# Altium project LSS_Top_Board_v3.5.PrjPcb (part 5 of 5)
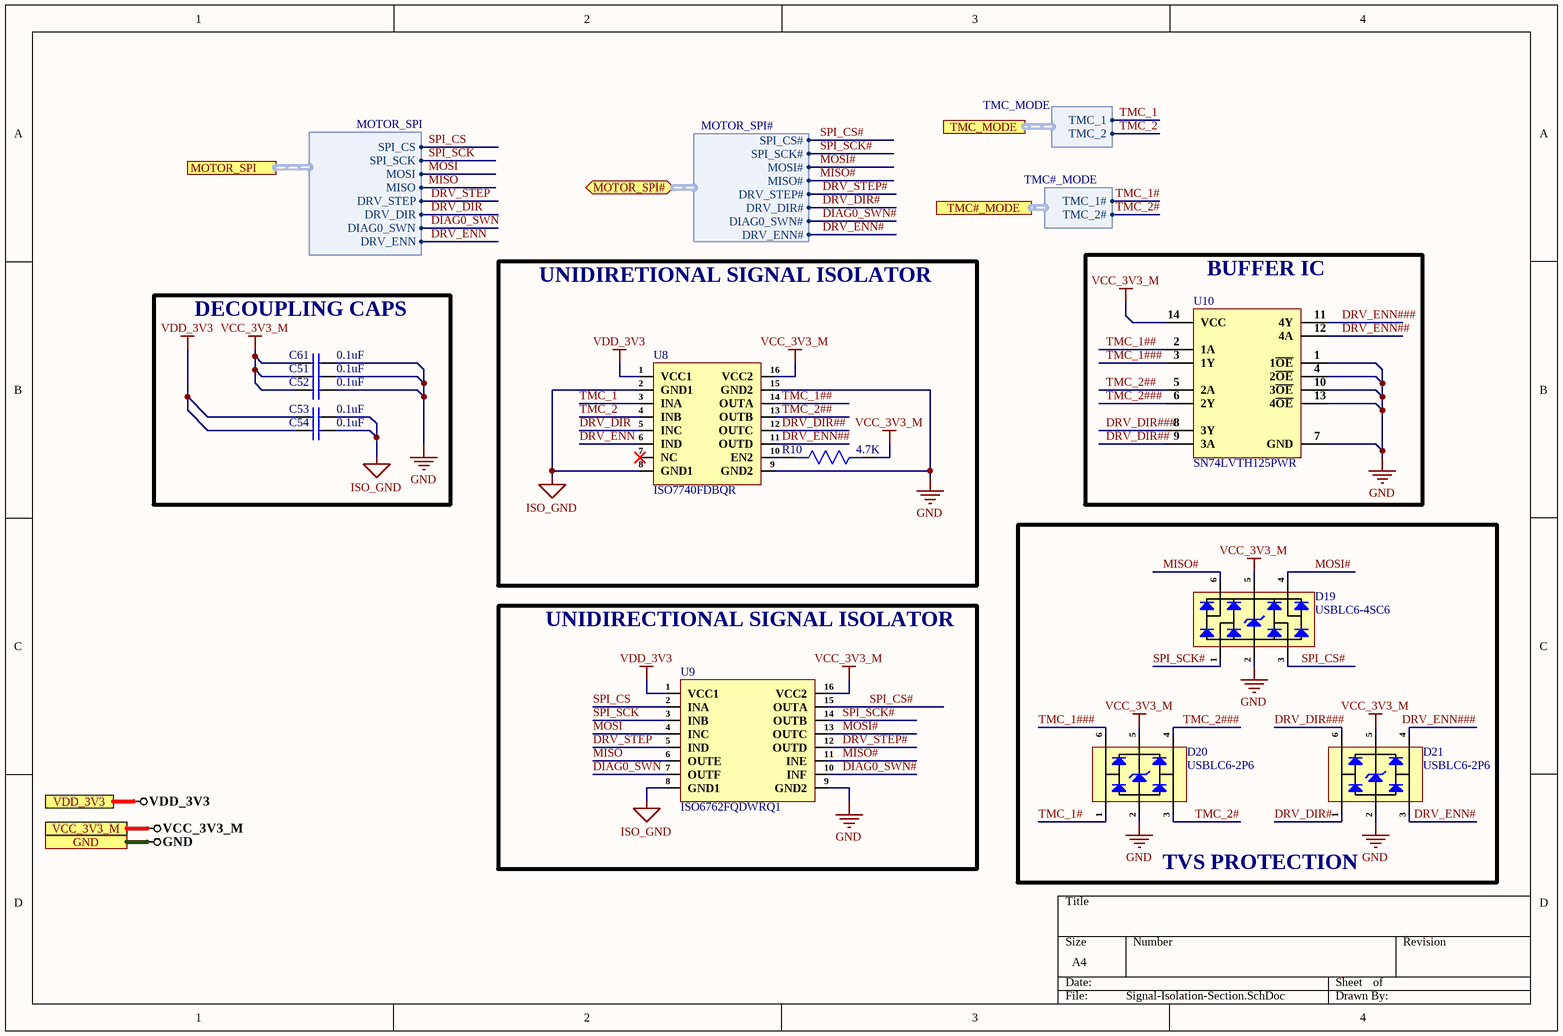
[diagram p8: Signal-Isolation-Section.SchDoc]

## Nets that join several sheets
5V: Isolated-Power-Section (C34.1 U4.3), Connector-Section (J3.A1)
GND: Isolated-Power-Section (13 pins), Motor-Supply-Section (19 pins), Connector-Section (6 pins), Motor-Driver-Sheet (23 pins), Driver-Sheet (C57.2 C58.2 C59.2 C60.2), Signal-Isolation-Section (14 pins)
ISO_GND: Isolated-Power-Section (15 pins), Connector-Section (22 pins), Signal-Isolation-Section (5 pins)
VCC_3V3_M: Motor-Supply-Section (FB3.2), Motor-Driver-Sheet (5 pins), Signal-Isolation-Section (10 pins)
VCC_12V: Isolated-Power-Section (6 pins), Motor-Supply-Section (C48.1 FB1.2 R41.2 U5.6), Motor-Driver-Sheet (C14.1 P3.1 U6.3 U6.4)
VDD_3V3: Isolated-Power-Section (D13.1 FB4.2), Connector-Section (6 pins), Signal-Isolation-Section (C53.1 C54.1 U8.1 U9.1)
VS: Motor-Supply-Section (5 pins), Connector-Section (C1.1 Q5.2), Motor-Driver-Sheet (8 pins), Driver-Sheet (8 pins)
DIAG0_SWN: Connector-Section (J3.B9), Signal-Isolation-Section (U9.7)
DIAG0_SWN#: Motor-Driver-Sheet (U6.26), Signal-Isolation-Section (U9.10)
DRV_DIR: Connector-Section (J3.B8), Signal-Isolation-Section (U8.5)
DRV_DIR#: Motor-Driver-Sheet (U6.18), Signal-Isolation-Section (D21.1)
DRV_ENN: Connector-Section (J3.B10), Signal-Isolation-Section (U8.6)
DRV_ENN#: Motor-Driver-Sheet (U6.28), Signal-Isolation-Section (D21.3)
DRV_STEP: Connector-Section (J3.B7), Signal-Isolation-Section (U9.5)
DRV_STEP#: Motor-Driver-Sheet (U6.17), Signal-Isolation-Section (U9.12)
HA1: Motor-Driver-Sheet (U6.41), Driver-Sheet (D4.2 R14.2)
HA2: Motor-Driver-Sheet (U6.36), Driver-Sheet (D5.2 R15.1)
HB1: Motor-Driver-Sheet (U6.1), Driver-Sheet (D6.2 R18.2)
HB2: Motor-Driver-Sheet (U6.44), Driver-Sheet (D10.2 R19.1)
LA1: Motor-Driver-Sheet (U6.39), Driver-Sheet (D8.2 R16.2)
LA2: Motor-Driver-Sheet (U6.38), Driver-Sheet (D9.2 R17.1)
LB1: Motor-Driver-Sheet (U6.47), Driver-Sheet (D7.2 R20.2)
LB2: Motor-Driver-Sheet (U6.46), Driver-Sheet (D11.2 R26.1)
MA1: Motor-Driver-Sheet (C26.1 J4.1 J11.1 U6.40), Driver-Sheet (C57.1 Q2.1 Q3.7 Q3.8)
MA2: Motor-Driver-Sheet (C27.1 J4.2 J11.2 U6.37), Driver-Sheet (C58.1 Q2.3 Q3.5 Q3.6)
MB1: Motor-Driver-Sheet (C28.1 J4.3 J11.3 U6.48), Driver-Sheet (C59.1 Q1.7 Q1.8 Q4.1)
MB2: Motor-Driver-Sheet (C31.1 J4.4 J11.4 U6.45), Driver-Sheet (C60.1 Q1.5 Q1.6 Q4.3)
MISO: Connector-Section (J3.B6), Signal-Isolation-Section (U9.6)
MISO#: Motor-Driver-Sheet (U6.16), Signal-Isolation-Section (D19.6 U9.11)
MOSI: Connector-Section (J3.B5), Signal-Isolation-Section (U9.4)
MOSI#: Motor-Driver-Sheet (U6.15), Signal-Isolation-Section (D19.4 U9.13)
SPI_CS: Connector-Section (J3.B3), Signal-Isolation-Section (U9.2)
SPI_CS#: Motor-Driver-Sheet (U6.13), Signal-Isolation-Section (D19.3 U9.15)
SPI_SCK: Connector-Section (J3.B4), Signal-Isolation-Section (U9.3)
SPI_SCK#: Motor-Driver-Sheet (U6.14), Signal-Isolation-Section (D19.1 U9.14)
SRAH: Motor-Driver-Sheet (R7.1 R12.1), Driver-Sheet (Q3.1 Q3.3)
SRBH: Motor-Driver-Sheet (R8.1 R13.1), Driver-Sheet (Q1.1 Q1.3)
TMC_1: Connector-Section (J3.A11), Signal-Isolation-Section (U8.3)
TMC_1#: Motor-Driver-Sheet (RF1.1 U6.21), Signal-Isolation-Section (D20.1)
TMC_2: Connector-Section (J3.A10), Signal-Isolation-Section (U8.4)
TMC_2#: Motor-Driver-Sheet (RF2.1 U6.22), Signal-Isolation-Section (D20.3)